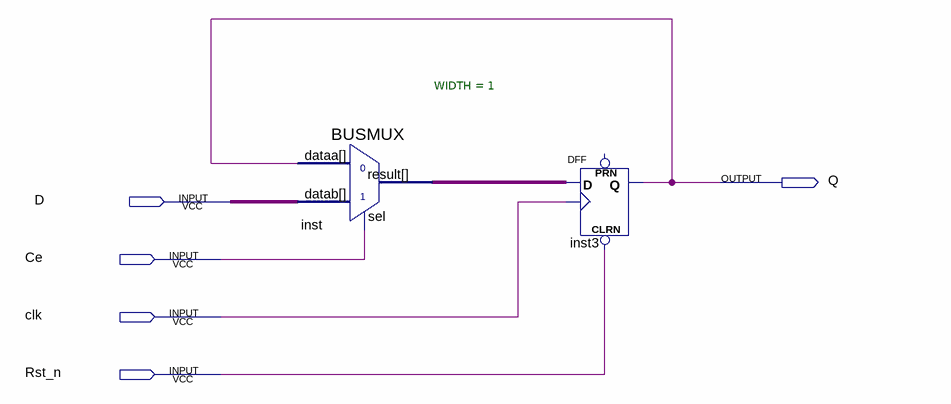
[diagram p0: schematic sheet]
// Quartus schematic week4_2.bdf as structural Verilog: 2 symbols, 5 pins
module week4_2 (
  input  D,
  input  Ce,
  input  clk,
  input  Rst_n,
  output Q
);

  wire inst_result;

  BUSMUX #(.WIDTH(1)) inst (.datab(D), .sel(Ce), .dataa(Q), .result(inst_result));
  DFF inst3 (.CLRN(Rst_n), .CLK(clk), .D(inst_result), .Q(Q));  // open: PRN
endmodule
